# EAGLE design LB_BIT_i1_SLIDESWITCH-v03(rev2) (EAGLE 6.6.0)
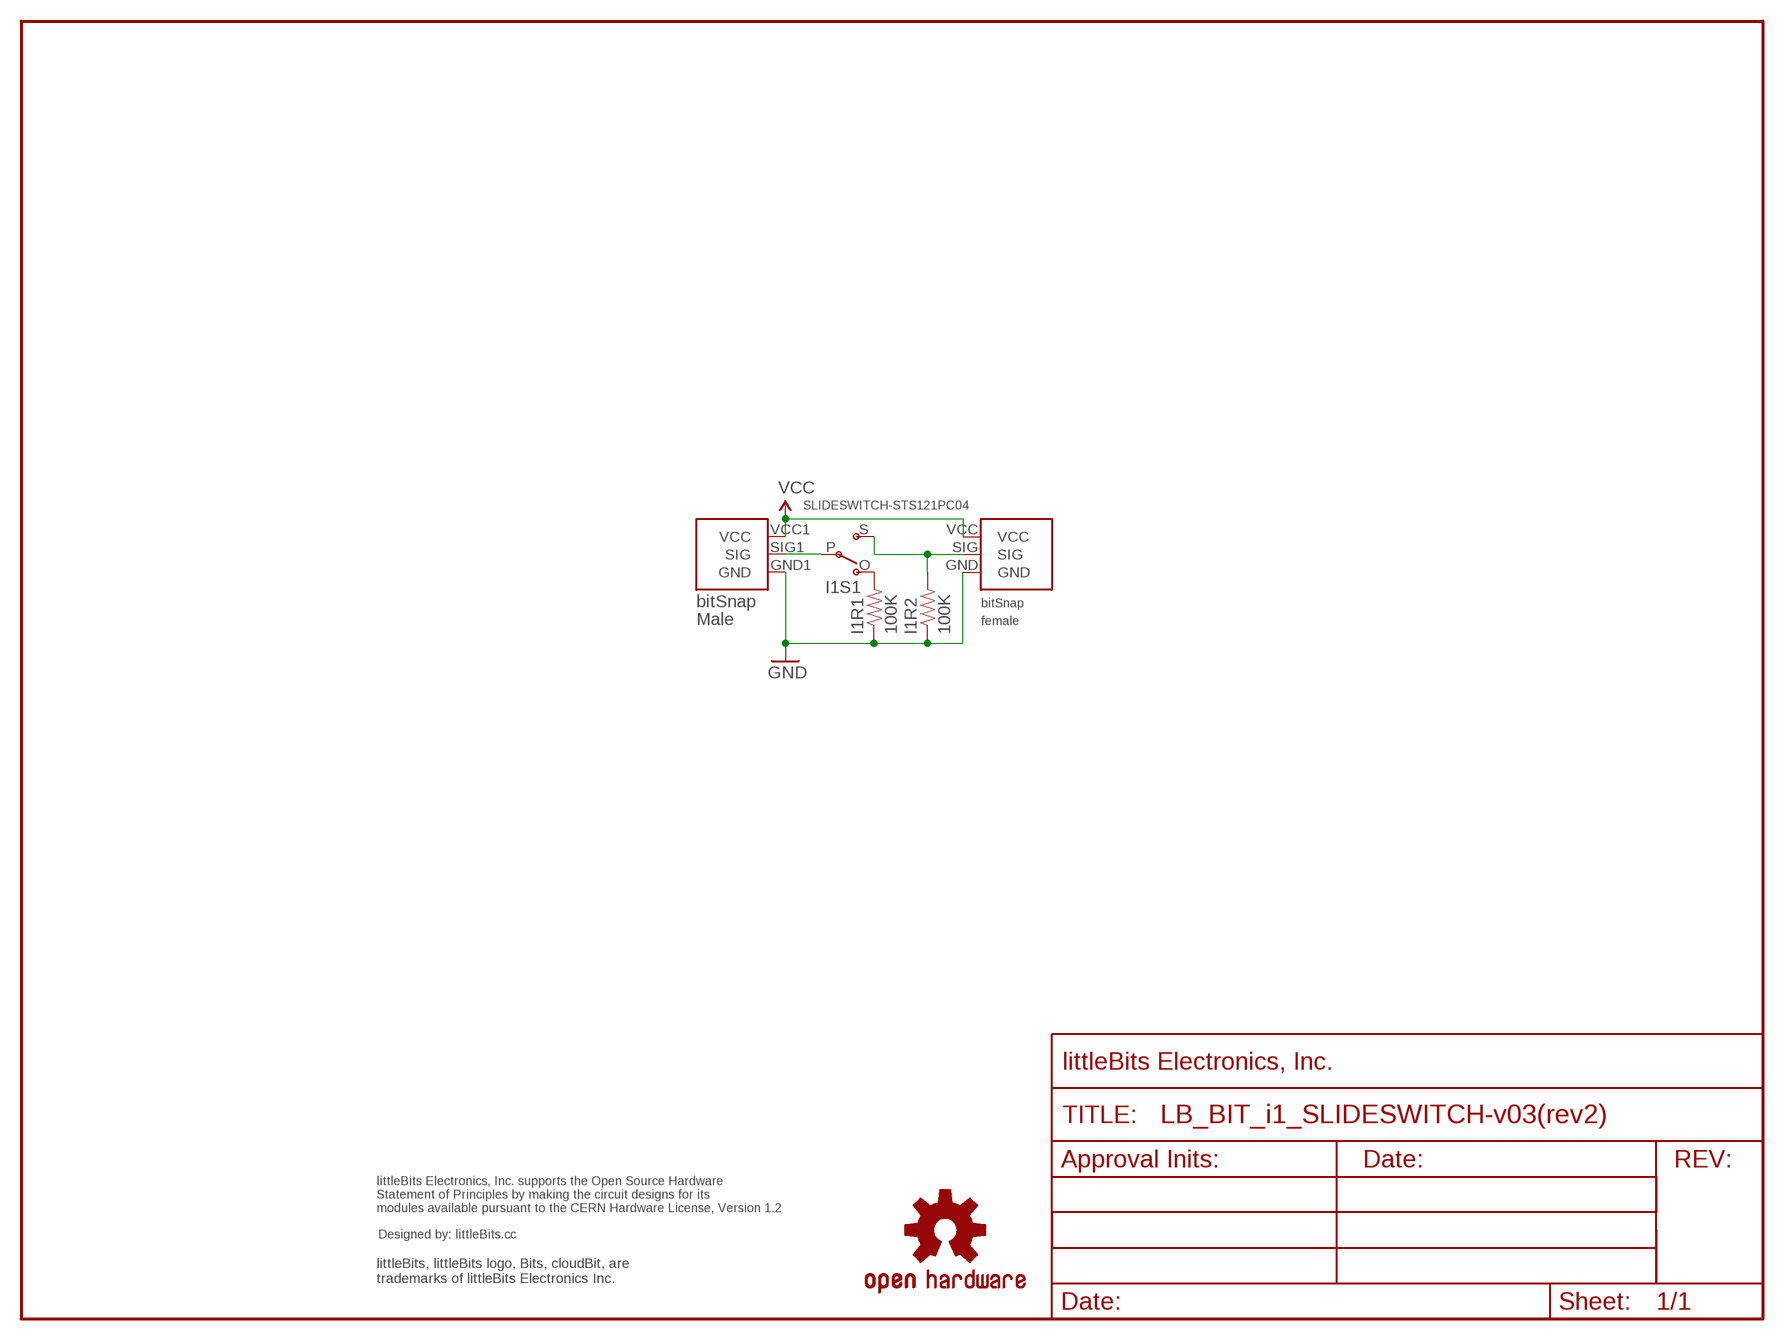
[diagram p0: schematic, sheet 1]

## Parts
I1BSF1  BITSNAP_V03_FEMALE  [BITSNAP_V03_FEMALE]
I1BSM1  BITSNAP_V03_MALE  [BITSNAP_V03_MALE]
I1R1  100K  RESISTOR0603-RES  [0603-RES]
I1R2  100K  RESISTOR0603-RES  [0603-RES]
I1S1  SLIDESWITCH-STS121PC04  [SLIDESWITCH-STS121PC04]
U$1  OSHW-LOGOL  [OSHW-LOGO-L]
U$2  FRAME-LETTER-OHWOHW  [FABDWG01-OHW]
U$3  LB_CREDITS  [OSHWCREDIT]

## Nets
GND: I1BSF1.GND I1BSM1.GND1(GND) I1R1.1 I1R2.1
N$1: I1BSF1.SIG I1R2.2 I1S1.S
N$3: I1BSM1.SIG1(SIG) I1S1.P
N$4: I1R1.2 I1S1.O
VCC: I1BSF1.VCC I1BSM1.VCC1(VCC)

## Library data of the parts
I1BSF1 = bitSnap:BITSNAP_V03_FEMALE
I1BSM1 = bitSnap:BITSNAP_V03_MALE
I1R1 I1R2 = SparkFun:RESISTOR: Resistor Basic schematic elements and footprints for 0603, 1206, and PTH 1/10th watt (small) resistors.
I1S1 = LITTLEBITS:SLIDESWITCH-STS121PC04
U$1 = LITTLEBITS:OSHW-LOGO: Open Source Hardware Logo This logo indicates the piece of hardware it is found on incorporates a OSHW license and/or adheres to the definition of open source hardware found here: http://freedomdefined.org/OSHW
U$2 = LITTLEBITS:FRAME-LETTER-OHW
U$3 = LITTLEBITS:LB_CREDITS

## Board
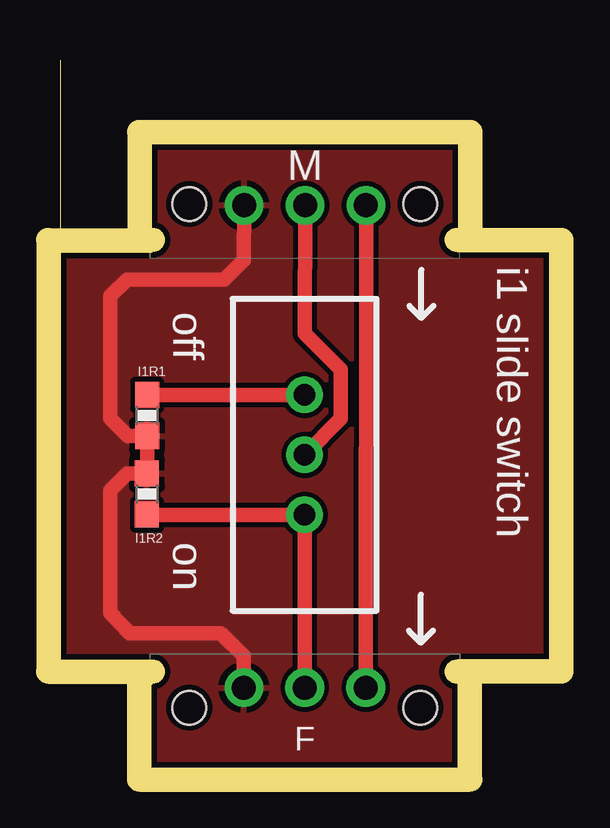
[diagram p1: board, top side]
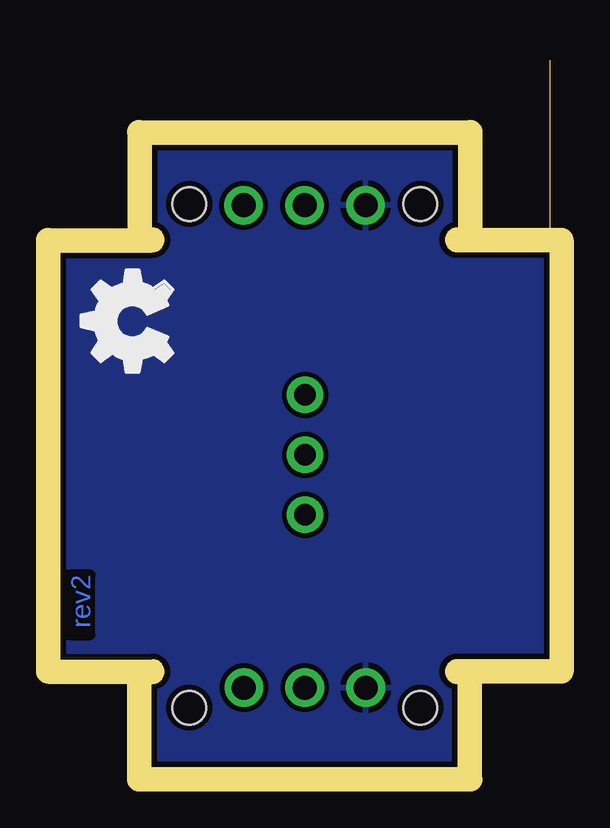
[diagram p2: board, bottom side, seen from below]

Size 20.4 x 29.5 mm. Coordinates in mm from the lower left corner, seen from the top.
Outline: 0,29.5 0,4.5
Outline: 20.4,4.5 20.4,21.5
Copper layers (1*16): Top 0.035mm / dielectric 1.5mm / Bottom 0.035mm
Design rules "default": minimum track width 8mil, minimum drill 20mil, track to track 8mil, track to pad 8mil, pad to pad 8mil, via to via 8mil, smd to smd 8mil, copper to edge 10mil, drill to drill 8mil, minimum pad ring 12mil, minimum via ring 10mil, stop-mask expansion 4mil, vias tented up to drill 25mil, thermal gap 10mil
Milling: 2 lines

### Footprints (pad centres in the part's own frame; a part is rotated, then mirrored left to right if it is on the bottom)
BITSNAP_V03_FEMALE = drill 1: GND 3.91,3.33; SIG 6.45,3.33; VCC 8.99,3.33 | hole 1.4: 1.63,2.5; 11.27,2.5
BITSNAP_V03_MALE = drill 1: GND1 8.98,2.56; SIG1 6.44,2.56; VCC1 3.9,2.56 | hole 1.4: 11.27,2.5; 1.63,2.5
0603-RES = smd 1.1 x 1: 1 -0.85,0; 2 0.85,0
SLIDESWITCH-STS121PC04 = drill 0.9: O 9,3; P 6.5,3; S 4,3

### Placement (x,y rotation side)
I1BSF1  3.75,0 0 top
I1BSM1  16.65,26 180 top
I1R1  3.63,14.68 90 top
I1R2  3.62,11.41 270 top
I1S1  13.19,6.54 90 top
U$1  -39.4,-17.35 0 top  (outside the outline)
U$2  0,0 0 top
U$3  -6.5,-27.8 0 top  (outside the outline)
U$6  [OSHW_FILLX150_NOTEXT]  15.7,15.66 0 top

### Tracks (layer width: path | path; a pad name or v marks a point on that pad's centre or on a via)
GND
  Top 0.61: I1BSM1.GND1 7.65,21.15 6.85,20.35 2.8,20.35 2.1,19.65 2.1,14.55 2.82,13.83 I1R1.1 I1R2.1 2.81,12.26 2.1,11.55 2.1,6.45 2.9,5.6 6.7,5.6 7.65,4.65 I1BSF1.GND
  pour Bottom: 0,0 0,26.1 20.4,26.1 20.4,0
  pour Top: 0,0 0,26.1 20.4,26.1 20.4,0
N$1
  Top 0.61: I1R2.2 3.62,10.54 I1S1.S I1BSF1.SIG
N$3
  Top 0.61: I1BSM1.SIG1 10.2,18.1 11.7,16.6 11.7,14.55 I1S1.P
N$4
  Top 0.61: I1S1.O I1R1.2
VCC
  Top 0.61: I1BSM1.VCC1 I1BSF1.VCC

### Text on the board
Bottom: rev2
tPlace: i1 slide switch | off | on
Milling: 1mm DIA. ROUTER PATH
Reference: MEDIUM